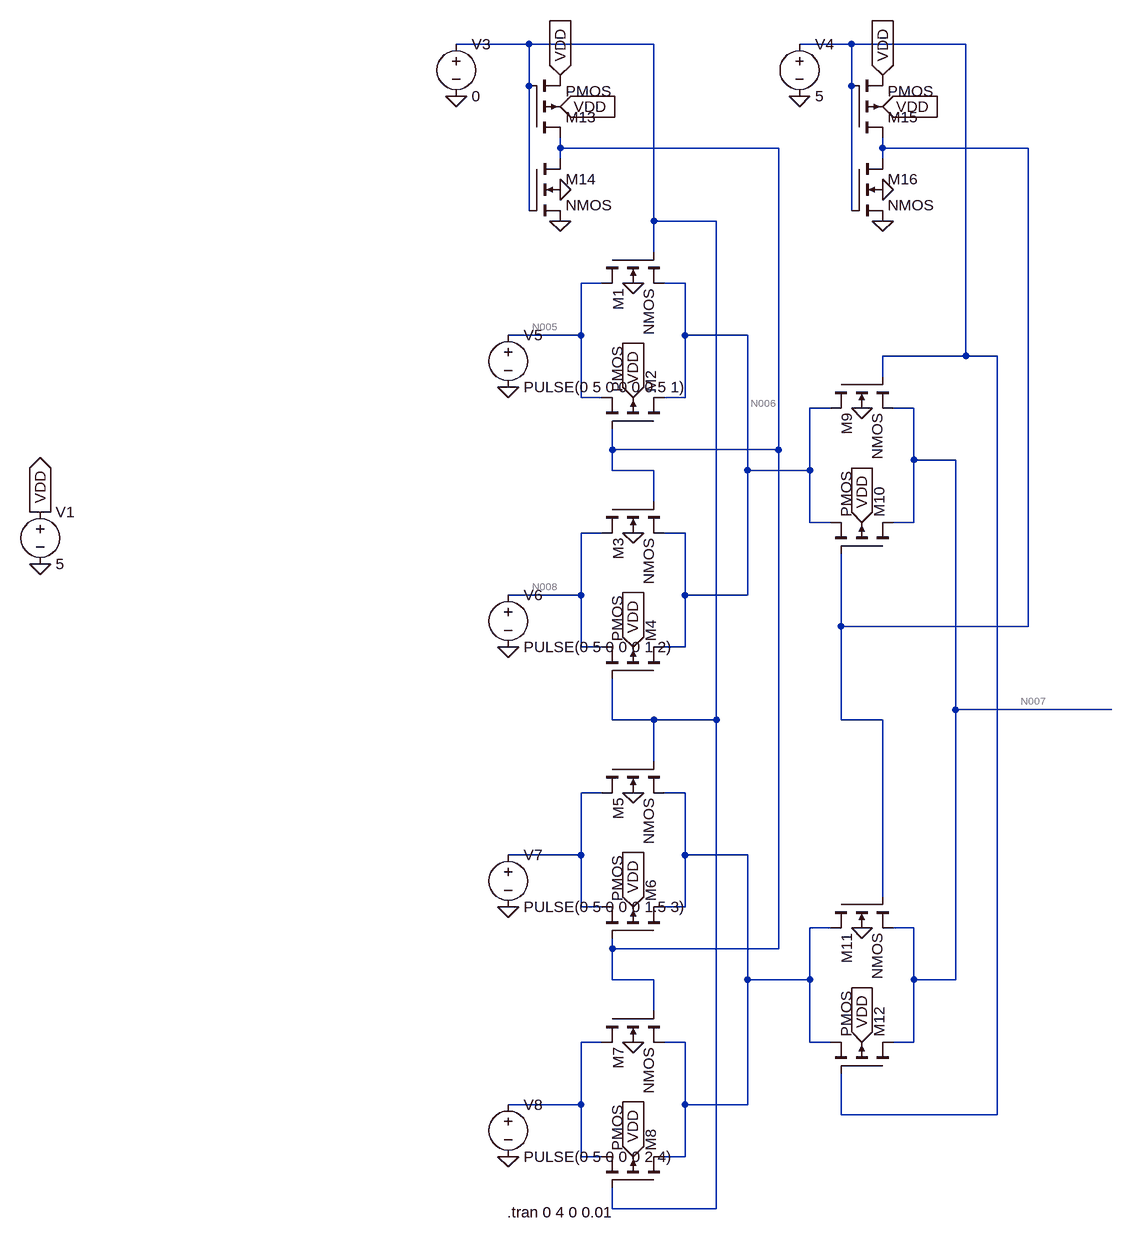
[diagram p0: schematic mux4to1pass.asc]
mux4to1pass.asc, the LTspice schematic file:
Version 4
SHEET 1 1028 1512
WIRE 128 -304 16 -304
WIRE 320 -304 128 -304
WIRE 624 -304 544 -304
WIRE 800 -304 624 -304
WIRE 128 -240 128 -304
WIRE 624 -240 624 -304
WIRE 176 -144 176 -160
WIRE 512 -144 176 -144
WIRE 672 -144 672 -160
WIRE 896 -144 672 -144
WIRE 176 -128 176 -144
WIRE 672 -128 672 -144
WIRE 128 -48 128 -240
WIRE 624 -48 624 -240
WIRE 320 -32 320 -304
WIRE 416 -32 320 -32
WIRE 320 16 320 -32
WIRE 240 64 208 64
WIRE 368 64 336 64
WIRE 208 144 208 64
WIRE 208 144 96 144
WIRE 368 144 368 64
WIRE 464 144 368 144
WIRE 800 176 800 -304
WIRE 800 176 672 176
WIRE 848 176 800 176
WIRE 672 208 672 176
WIRE 208 240 208 144
WIRE 240 240 208 240
WIRE 368 240 368 144
WIRE 368 240 336 240
WIRE 592 256 560 256
WIRE 720 256 688 256
WIRE 256 320 256 288
WIRE 512 320 512 -144
WIRE 512 320 256 320
WIRE 720 336 720 256
WIRE 784 336 720 336
WIRE 256 352 256 320
WIRE 320 352 256 352
WIRE 464 352 464 144
WIRE 560 352 560 256
WIRE 560 352 464 352
WIRE 320 400 320 352
WIRE 560 432 560 352
WIRE 592 432 560 432
WIRE 720 432 720 336
WIRE 720 432 688 432
WIRE 240 448 208 448
WIRE 368 448 336 448
WIRE 208 544 208 448
WIRE 208 544 96 544
WIRE 368 544 368 448
WIRE 464 544 464 352
WIRE 464 544 368 544
WIRE 608 592 608 480
WIRE 896 592 896 -144
WIRE 896 592 608 592
WIRE 208 624 208 544
WIRE 240 624 208 624
WIRE 368 624 368 544
WIRE 368 624 336 624
WIRE 784 720 784 336
WIRE 1024 720 784 720
WIRE 256 736 256 672
WIRE 320 736 256 736
WIRE 416 736 416 -32
WIRE 416 736 320 736
WIRE 608 736 608 592
WIRE 672 736 608 736
WIRE 320 800 320 736
WIRE 240 848 208 848
WIRE 368 848 336 848
WIRE 208 944 208 848
WIRE 208 944 96 944
WIRE 368 944 368 848
WIRE 464 944 368 944
WIRE 672 1008 672 736
WIRE 208 1024 208 944
WIRE 240 1024 208 1024
WIRE 368 1024 368 944
WIRE 368 1024 336 1024
WIRE 592 1056 560 1056
WIRE 720 1056 688 1056
WIRE 256 1088 256 1072
WIRE 512 1088 512 320
WIRE 512 1088 256 1088
WIRE 256 1136 256 1088
WIRE 320 1136 256 1136
WIRE 464 1136 464 944
WIRE 560 1136 560 1056
WIRE 560 1136 464 1136
WIRE 720 1136 720 1056
WIRE 784 1136 784 720
WIRE 784 1136 720 1136
WIRE 320 1184 320 1136
WIRE 240 1232 208 1232
WIRE 368 1232 336 1232
WIRE 560 1232 560 1136
WIRE 592 1232 560 1232
WIRE 720 1232 720 1136
WIRE 720 1232 688 1232
WIRE 208 1328 208 1232
WIRE 208 1328 96 1328
WIRE 368 1328 368 1232
WIRE 464 1328 464 1136
WIRE 464 1328 368 1328
WIRE 608 1344 608 1280
WIRE 848 1344 848 176
WIRE 848 1344 608 1344
WIRE 208 1408 208 1328
WIRE 240 1408 208 1408
WIRE 368 1408 368 1328
WIRE 368 1408 336 1408
WIRE 256 1488 256 1456
WIRE 416 1488 416 736
WIRE 416 1488 256 1488
FLAG 288 64 0
FLAG 288 240 VDD
IOPIN 288 240 In
FLAG 288 448 0
FLAG 288 624 VDD
IOPIN 288 624 In
FLAG 288 848 0
FLAG 288 1024 VDD
IOPIN 288 1024 In
FLAG 288 1232 0
FLAG 288 1408 VDD
IOPIN 288 1408 In
FLAG 640 256 0
FLAG 640 432 VDD
IOPIN 640 432 In
FLAG 640 1056 0
FLAG 640 1232 VDD
IOPIN 640 1232 In
FLAG 176 -256 VDD
IOPIN 176 -256 In
FLAG 176 -32 0
FLAG 672 -256 VDD
IOPIN 672 -256 In
FLAG 672 -32 0
FLAG 176 -208 VDD
IOPIN 176 -208 In
FLAG 672 -208 VDD
IOPIN 672 -208 In
FLAG 672 -80 0
FLAG 176 -80 0
FLAG -624 496 0
FLAG -624 416 VDD
IOPIN -624 416 Out
FLAG 16 -224 0
FLAG 544 -224 0
FLAG 96 224 0
FLAG 96 624 0
FLAG 96 1024 0
FLAG 96 1408 0
SYMBOL nmos4 240 16 M90
WINDOW 0 56 25 Left 2
SYMATTR InstName M1
SYMBOL pmos4 336 288 M270
WINDOW 0 56 21 Left 2
SYMATTR InstName M2
SYMBOL nmos4 240 400 M90
WINDOW 0 56 25 Left 2
SYMATTR InstName M3
SYMBOL pmos4 336 672 M270
WINDOW 0 56 21 Left 2
SYMATTR InstName M4
SYMBOL nmos4 240 800 M90
WINDOW 0 56 25 Left 2
SYMATTR InstName M5
SYMBOL pmos4 336 1072 M270
WINDOW 0 56 21 Left 2
SYMATTR InstName M6
SYMBOL nmos4 240 1184 M90
WINDOW 0 56 25 Left 2
SYMATTR InstName M7
SYMBOL pmos4 336 1456 M270
WINDOW 0 56 21 Left 2
SYMATTR InstName M8
SYMBOL nmos4 592 208 M90
WINDOW 0 56 25 Left 2
SYMATTR InstName M9
SYMBOL pmos4 688 480 M270
WINDOW 0 56 21 Left 2
SYMATTR InstName M10
SYMBOL nmos4 592 1008 M90
WINDOW 0 56 25 Left 2
SYMATTR InstName M11
SYMBOL pmos4 688 1280 M270
WINDOW 0 56 21 Left 2
SYMATTR InstName M12
SYMBOL pmos4 128 -160 M180
SYMATTR InstName M13
SYMBOL nmos4 128 -128 R0
SYMATTR InstName M14
SYMBOL pmos4 624 -160 M180
SYMATTR InstName M15
SYMBOL nmos4 624 -128 R0
SYMATTR InstName M16
SYMBOL voltage -624 400 R0
WINDOW 123 0 0 Left 0
WINDOW 39 0 0 Left 0
SYMATTR InstName V1
SYMATTR Value 5
SYMBOL voltage 16 -320 R0
WINDOW 123 0 0 Left 0
WINDOW 39 0 0 Left 0
SYMATTR InstName V3
SYMATTR Value 0
SYMBOL voltage 544 -320 R0
WINDOW 123 0 0 Left 0
WINDOW 39 0 0 Left 0
SYMATTR InstName V4
SYMATTR Value 5
SYMBOL voltage 96 128 R0
WINDOW 123 0 0 Left 0
WINDOW 39 0 0 Left 0
SYMATTR InstName V5
SYMATTR Value PULSE(0 5 0 0 0 0.5 1)
SYMBOL voltage 96 528 R0
WINDOW 123 0 0 Left 0
WINDOW 39 0 0 Left 0
SYMATTR InstName V6
SYMATTR Value PULSE(0 5 0 0 0 1 2)
SYMBOL voltage 96 928 R0
WINDOW 123 0 0 Left 0
WINDOW 39 0 0 Left 0
SYMATTR InstName V7
SYMATTR Value PULSE(0 5 0 0 0 1.5 3)
SYMBOL voltage 96 1312 R0
WINDOW 123 0 0 Left 0
WINDOW 39 0 0 Left 0
SYMATTR InstName V8
SYMATTR Value PULSE(0 5 0 0 0 2 4)
TEXT 94 1494 Left 2 !.tran 0 4 0 0.01

The netlist it stands for:
* mux4to1pass.asc
M1 N005 N001 N006 0 NMOS
M2 N006 N003 N005 VDD PMOS
M3 N008 N003 N006 0 NMOS
M4 N006 N001 N008 VDD PMOS
M5 N009 N001 N010 0 NMOS
M6 N010 N003 N009 VDD PMOS
M7 N011 N003 N010 0 NMOS
M8 N010 N001 N011 VDD PMOS
M9 N006 N002 N007 0 NMOS
M10 N007 N004 N006 VDD PMOS
M11 N010 N004 N007 0 NMOS
M12 N007 N002 N010 VDD PMOS
M13 N003 N001 VDD VDD PMOS
M14 N003 N001 0 0 NMOS
M15 N004 N002 VDD VDD PMOS
M16 N004 N002 0 0 NMOS
V1 VDD 0 5
V3 N001 0 0
V4 N002 0 5
V5 N005 0 PULSE(0 5 0 0 0 0.5 1)
V6 N008 0 PULSE(0 5 0 0 0 1 2)
V7 N009 0 PULSE(0 5 0 0 0 1.5 3)
V8 N011 0 PULSE(0 5 0 0 0 2 4)
.model NMOS NMOS
.model PMOS PMOS
.lib standard.mos
.tran 0 4 0 0.01
.backanno
.end

* Results of the author's LTspice run, read from the files saved beside the schematic
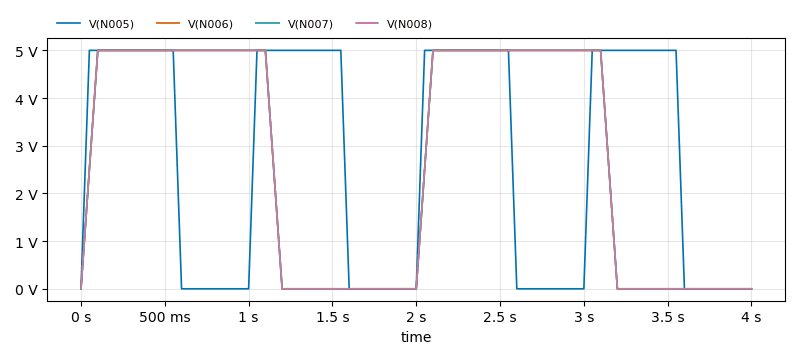
[diagram p1: Transient Analysis of mux4to1pass.asc, plotted from the saved traces]
* Transient Analysis, 1 run:
*   V(N005): min 0 V, max 5 V, average 2.75 V, rms 3.708 V, last 0 V
*   V(N006): min 0 V, max 5 V, average 2.75 V, rms 3.676 V, last 0 V
*   V(N007): min 0 V, max 5 V, average 2.75 V, rms 3.676 V, last 0 V
*   V(N008): min 0 V, max 5 V, average 2.75 V, rms 3.676 V, last 0 V